# Altium schematic sheet 0207_TBT_0_HISPEED.SchDoc
size A3
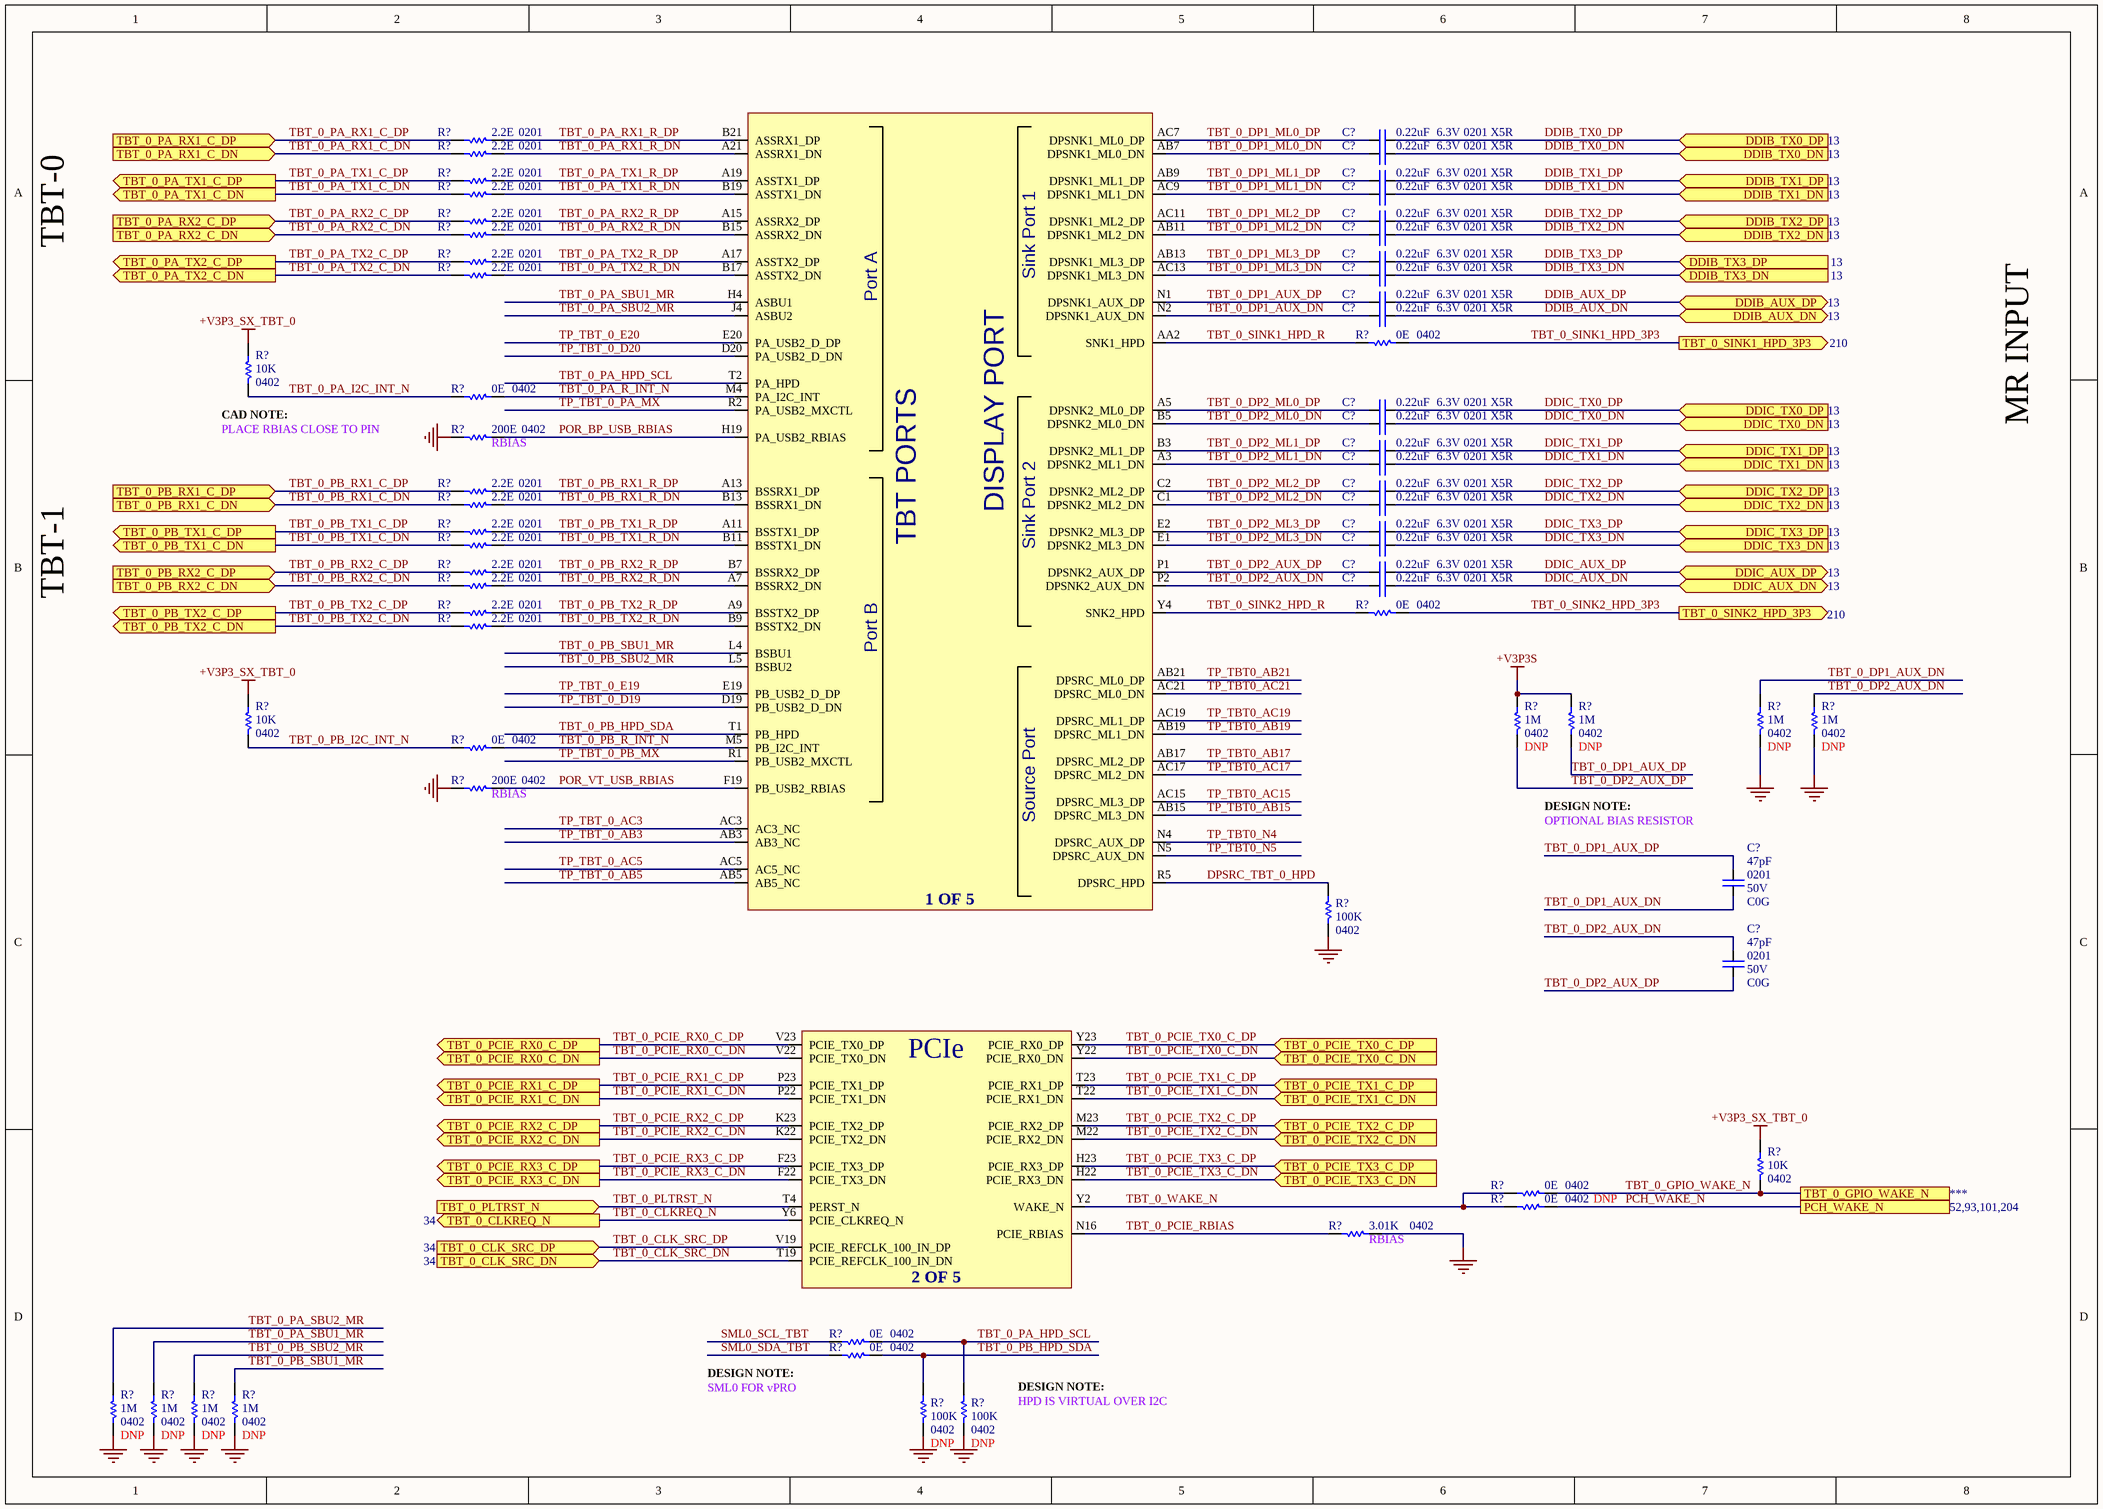
[diagram p0: 0207_TBT_0_HISPEED.SchDoc]

## Parts
(Parts that share a designator on the sheet are numbered #1, #2 ... from top to bottom, then left to right.)
C?#1  value 0.22uF  Case/Package: 0201  Voltage: 6.3V  Dielectric: X5R  [CAPC0201]
C?#2  value 0.22uF  Case/Package: 0201  Voltage: 6.3V  Dielectric: X5R  [CAPC0201]
C?#3  value 0.22uF  Case/Package: 0201  Voltage: 6.3V  Dielectric: X5R  [CAPC0201]
C?#4  value 0.22uF  Case/Package: 0201  Voltage: 6.3V  Dielectric: X5R  [CAPC0201]
C?#5  value 0.22uF  Case/Package: 0201  Voltage: 6.3V  Dielectric: X5R  [CAPC0201]
C?#6  value 0.22uF  Case/Package: 0201  Voltage: 6.3V  Dielectric: X5R  [CAPC0201]
C?#7  value 0.22uF  Case/Package: 0201  Voltage: 6.3V  Dielectric: X5R  [CAPC0201]
C?#8  value 0.22uF  Case/Package: 0201  Voltage: 6.3V  Dielectric: X5R  [CAPC0201]
C?#9  value 0.22uF  Case/Package: 0201  Voltage: 6.3V  Dielectric: X5R  [CAPC0201]
C?#10  value 0.22uF  Case/Package: 0201  Voltage: 6.3V  Dielectric: X5R  [CAPC0201]
C?#11  value 0.22uF  Case/Package: 0201  Voltage: 6.3V  Dielectric: X5R  [CAPC0201]
C?#12  value 0.22uF  Case/Package: 0201  Voltage: 6.3V  Dielectric: X5R  [CAPC0201]
C?#13  value 0.22uF  Case/Package: 0201  Voltage: 6.3V  Dielectric: X5R  [CAPC0201]
C?#14  value 0.22uF  Case/Package: 0201  Voltage: 6.3V  Dielectric: X5R  [CAPC0201]
C?#15  value 0.22uF  Case/Package: 0201  Voltage: 6.3V  Dielectric: X5R  [CAPC0201]
C?#16  value 0.22uF  Case/Package: 0201  Voltage: 6.3V  Dielectric: X5R  [CAPC0201]
C?#17  value 0.22uF  Case/Package: 0201  Voltage: 6.3V  Dielectric: X5R  [CAPC0201]
C?#18  value 0.22uF  Case/Package: 0201  Voltage: 6.3V  Dielectric: X5R  [CAPC0201]
C?#19  value 0.22uF  Case/Package: 0201  Voltage: 6.3V  Dielectric: X5R  [CAPC0201]
C?#20  value 0.22uF  Case/Package: 0201  Voltage: 6.3V  Dielectric: X5R  [CAPC0201]
C?#21  value 47pF  Case/Package: 0201  Voltage: 50V  Dielectric: C0G  [CAPC0201]
C?#22  value 47pF  Case/Package: 0201  Voltage: 50V  Dielectric: C0G  [CAPC0201]
R?#1  value 2.2E  Case/Package: 0201  [RESC0201]  (hidden comment: Res)
R?#2  value 2.2E  Case/Package: 0201  [RESC0201]  (hidden comment: Res)
R?#3  value 2.2E  Case/Package: 0201  [RESC0201]  (hidden comment: Res)
R?#4  value 2.2E  Case/Package: 0201  [RESC0201]  (hidden comment: Res)
R?#5  value 2.2E  Case/Package: 0201  [RESC0201]  (hidden comment: Res)
R?#6  value 2.2E  Case/Package: 0201  [RESC0201]  (hidden comment: Res)
R?#7  value 2.2E  Case/Package: 0201  [RESC0201]  (hidden comment: Res)
R?#8  value 2.2E  Case/Package: 0201  [RESC0201]  (hidden comment: Res)
R?#9  value 0E  Case/Package: 0402  [RESC0402]  (hidden comment: Res)
R?#10  value 10K  Case/Package: 0402  [RESC0402]  (hidden comment: Res)
R?#11  value 0E  Case/Package: 0402  [RESC0402]  (hidden comment: Res)
R?#12  value 200E  Case/Package: 0402  [RESC0402]  (hidden comment: Res)
R?#13  value 2.2E  Case/Package: 0201  [RESC0201]  (hidden comment: Res)
R?#14  value 2.2E  Case/Package: 0201  [RESC0201]  (hidden comment: Res)
R?#15  value 2.2E  Case/Package: 0201  [RESC0201]  (hidden comment: Res)
R?#16  value 2.2E  Case/Package: 0201  [RESC0201]  (hidden comment: Res)
R?#17  value 2.2E  Case/Package: 0201  [RESC0201]  (hidden comment: Res)
R?#18  value 2.2E  Case/Package: 0201  [RESC0201]  (hidden comment: Res)
R?#19  value 2.2E  Case/Package: 0201  [RESC0201]  (hidden comment: Res)
R?#20  value 0E  Case/Package: 0402  [RESC0402]  (hidden comment: Res)
R?#21  value 2.2E  Case/Package: 0201  [RESC0201]  (hidden comment: Res)
R?#22  value 10K  Case/Package: 0402  [RESC0402]  (hidden comment: Res)
R?#23  value 1M  Case/Package: 0402  [RESC0402]  (hidden comment: Res)
R?#24  value 1M  Case/Package: 0402  [RESC0402]  (hidden comment: Res)
R?#25  value 1M  Case/Package: 0402  [RESC0402]  (hidden comment: Res)
R?#26  value 1M  Case/Package: 0402  [RESC0402]  (hidden comment: Res)
R?#27  value 0E  Case/Package: 0402  [RESC0402]  (hidden comment: Res)
R?#28  value 200E  Case/Package: 0402  [RESC0402]  (hidden comment: Res)
R?#29  value 100K  Case/Package: 0402  [RESC0402]  (hidden comment: Res)
R?#30  value 10K  Case/Package: 0402  [RESC0402]  (hidden comment: Res)
R?#31  value 0E  Case/Package: 0402  [RESC0402]  (hidden comment: Res)
R?#32  value 0E  Case/Package: 0402  [RESC0402]  (hidden comment: Res)
R?#33  value 3.01K  Case/Package: 0402  [RESC0402]  (hidden comment: Res)
R?#34  value 0E  Case/Package: 0402  [RESC0402]  (hidden comment: Res)
R?#35  value 0E  Case/Package: 0402  [RESC0402]  (hidden comment: Res)
R?#36  value 1M  Case/Package: 0402  [RESC0402]  (hidden comment: Res)
R?#37  value 1M  Case/Package: 0402  [RESC0402]  (hidden comment: Res)
R?#38  value 1M  Case/Package: 0402  [RESC0402]  (hidden comment: Res)
R?#39  value 1M  Case/Package: 0402  [RESC0402]  (hidden comment: Res)
R?#40  value 100K  Case/Package: 0402  [RESC0402]  (hidden comment: Res)
R?#41  value 100K  Case/Package: 0402  [RESC0402]  (hidden comment: Res)
U5A2  C_MAPLE_RIDGE_DP  (value not drawn)  (parts A,B of 5)

## Ports
DDIB_AUX_DN (bidir), DDIB_AUX_DP (bidir), DDIB_TX0_DN (in), DDIB_TX0_DP (in), DDIB_TX1_DN (in), DDIB_TX1_DP (in), DDIB_TX2_DN (in), DDIB_TX2_DP (in), DDIB_TX3_DN (in), DDIB_TX3_DP (in), DDIC_AUX_DN (bidir), DDIC_AUX_DP (bidir), DDIC_TX0_DN (in), DDIC_TX0_DP (in), DDIC_TX1_DN (in), DDIC_TX1_DP (in), DDIC_TX2_DN (in), DDIC_TX2_DP (in), DDIC_TX3_DN (in), DDIC_TX3_DP (in), PCH_WAKE_N, TBT_0_CLK_SRC_DN (in), TBT_0_CLK_SRC_DP (in), TBT_0_CLKREQ_N (out), TBT_0_GPIO_WAKE_N, TBT_0_PA_RX1_C_DN (in), TBT_0_PA_RX1_C_DP (in), TBT_0_PA_RX2_C_DN (in), TBT_0_PA_RX2_C_DP (in), TBT_0_PA_TX1_C_DN (out), TBT_0_PA_TX1_C_DP (out), TBT_0_PA_TX2_C_DN (out), TBT_0_PA_TX2_C_DP (out), TBT_0_PB_RX1_C_DN (in), TBT_0_PB_RX1_C_DP (in), TBT_0_PB_RX2_C_DN (in), TBT_0_PB_RX2_C_DP (in), TBT_0_PB_TX1_C_DN (out), TBT_0_PB_TX1_C_DP (out), TBT_0_PB_TX2_C_DN (out), TBT_0_PB_TX2_C_DP (out), TBT_0_PCIE_RX0_C_DN (out), TBT_0_PCIE_RX0_C_DP (out), TBT_0_PCIE_RX1_C_DN (out), TBT_0_PCIE_RX1_C_DP (out), TBT_0_PCIE_RX2_C_DN (out), TBT_0_PCIE_RX2_C_DP (out), TBT_0_PCIE_RX3_C_DN (out), TBT_0_PCIE_RX3_C_DP (out), TBT_0_PCIE_TX0_C_DN (in), TBT_0_PCIE_TX0_C_DP (in), TBT_0_PCIE_TX1_C_DN (in), TBT_0_PCIE_TX1_C_DP (in), TBT_0_PCIE_TX2_C_DN (in), TBT_0_PCIE_TX2_C_DP (in), TBT_0_PCIE_TX3_C_DN (in), TBT_0_PCIE_TX3_C_DP (in), TBT_0_PLTRST_N (in), TBT_0_SINK1_HPD_3P3 (out), TBT_0_SINK2_HPD_3P3 (out)

## Nets
+V3P3_SX_TBT_0: R?#10.2 R?#22.2 R?#30.2
+V3P3S: R?#23.2 R?#24.2
GND: R?#12.1 R?#25.1 R?#26.1 R?#28.1 R?#29.1 R?#33.1 R?#36.1 R?#37.1 R?#38.1 R?#39.1 R?#40.1 R?#41.1
DDIB_AUX_DN: C?#10.2 ; port DDIB_AUX_DN
DDIB_AUX_DP: C?#9.2 ; port DDIB_AUX_DP
DDIB_TX0_DN: C?#2.2 ; port DDIB_TX0_DN
DDIB_TX0_DP: C?#1.2 ; port DDIB_TX0_DP
DDIB_TX1_DN: C?#4.2 ; port DDIB_TX1_DN
DDIB_TX1_DP: C?#3.2 ; port DDIB_TX1_DP
DDIB_TX2_DN: C?#6.2 ; port DDIB_TX2_DN
DDIB_TX2_DP: C?#5.2 ; port DDIB_TX2_DP
DDIB_TX3_DN: C?#8.2 ; port DDIB_TX3_DN
DDIB_TX3_DP: C?#7.2 ; port DDIB_TX3_DP
DDIC_AUX_DN: C?#20.2 ; port DDIC_AUX_DN
DDIC_AUX_DP: C?#19.2 ; port DDIC_AUX_DP
DDIC_TX0_DN: C?#12.2 ; port DDIC_TX0_DN
DDIC_TX0_DP: C?#11.2 ; port DDIC_TX0_DP
DDIC_TX1_DN: C?#14.2 ; port DDIC_TX1_DN
DDIC_TX1_DP: C?#13.2 ; port DDIC_TX1_DP
DDIC_TX2_DN: C?#16.2 ; port DDIC_TX2_DN
DDIC_TX2_DP: C?#15.2 ; port DDIC_TX2_DP
DDIC_TX3_DN: C?#18.2 ; port DDIC_TX3_DN
DDIC_TX3_DP: C?#17.2 ; port DDIC_TX3_DP
DPSRC_TBT_0_HPD: R?#29.2 U5A2.R5(DPSRC_HPD)
PCH_WAKE_N: R?#32.2 ; port PCH_WAKE_N
POR_BP_USB_RBIAS: R?#12.2 U5A2.H19(PA_USB2_RBIAS)
POR_VT_USB_RBIAS: R?#28.2 U5A2.F19(PB_USB2_RBIAS)
SML0_SCL_TBT: R?#34.1
SML0_SDA_TBT: R?#35.1
TBT_0_CLK_SRC_DN: U5A2.T19(PCIE_REFCLK_100_IN_DN) ; port TBT_0_CLK_SRC_DN
TBT_0_CLK_SRC_DP: U5A2.V19(PCIE_REFCLK_100_IN_DP) ; port TBT_0_CLK_SRC_DP
TBT_0_CLKREQ_N: U5A2.Y6(PCIE_CLKREQ_N) ; port TBT_0_CLKREQ_N
TBT_0_DP1_AUX_DN: C?#10.1 C?#21.2 R?#25.2 U5A2.N2(DPSNK1_AUX_DN)
TBT_0_DP1_AUX_DP: C?#9.1 C?#21.1 R?#24.1 U5A2.N1(DPSNK1_AUX_DP)
TBT_0_DP1_ML0_DN: C?#2.1 U5A2.AB7(DPSNK1_ML0_DN)
TBT_0_DP1_ML0_DP: C?#1.1 U5A2.AC7(DPSNK1_ML0_DP)
TBT_0_DP1_ML1_DN: C?#4.1 U5A2.AC9(DPSNK1_ML1_DN)
TBT_0_DP1_ML1_DP: C?#3.1 U5A2.AB9(DPSNK1_ML1_DP)
TBT_0_DP1_ML2_DN: C?#6.1 U5A2.AB11(DPSNK1_ML2_DN)
TBT_0_DP1_ML2_DP: C?#5.1 U5A2.AC11(DPSNK1_ML2_DP)
TBT_0_DP1_ML3_DN: C?#8.1 U5A2.AC13(DPSNK1_ML3_DN)
TBT_0_DP1_ML3_DP: C?#7.1 U5A2.AB13(DPSNK1_ML3_DP)
TBT_0_DP2_AUX_DN: C?#20.1 C?#22.1 R?#26.2 U5A2.P2(DPSNK2_AUX_DN)
TBT_0_DP2_AUX_DP: C?#19.1 C?#22.2 R?#23.1 U5A2.P1(DPSNK2_AUX_DP)
TBT_0_DP2_ML0_DN: C?#12.1 U5A2.B5(DPSNK2_ML0_DN)
TBT_0_DP2_ML0_DP: C?#11.1 U5A2.A5(DPSNK2_ML0_DP)
TBT_0_DP2_ML1_DN: C?#14.1 U5A2.A3(DPSNK2_ML1_DN)
TBT_0_DP2_ML1_DP: C?#13.1 U5A2.B3(DPSNK2_ML1_DP)
TBT_0_DP2_ML2_DN: C?#16.1 U5A2.C1(DPSNK2_ML2_DN)
TBT_0_DP2_ML2_DP: C?#15.1 U5A2.C2(DPSNK2_ML2_DP)
TBT_0_DP2_ML3_DN: C?#18.1 U5A2.E1(DPSNK2_ML3_DN)
TBT_0_DP2_ML3_DP: C?#17.1 U5A2.E2(DPSNK2_ML3_DP)
TBT_0_GPIO_WAKE_N: R?#30.1 R?#31.2 ; port TBT_0_GPIO_WAKE_N
TBT_0_PA_HPD_SCL: R?#34.2 R?#41.2 U5A2.T2(PA_HPD)
TBT_0_PA_I2C_INT_N: R?#10.1 R?#11.1
TBT_0_PA_R_INT_N: R?#11.2 U5A2.M4(PA_I2C_INT)
TBT_0_PA_RX1_C_DN: R?#2.1 ; port TBT_0_PA_RX1_C_DN
TBT_0_PA_RX1_C_DP: R?#1.1 ; port TBT_0_PA_RX1_C_DP
TBT_0_PA_RX1_R_DN: R?#2.2 U5A2.A21(ASSRX1_DN)
TBT_0_PA_RX1_R_DP: R?#1.2 U5A2.B21(ASSRX1_DP)
TBT_0_PA_RX2_C_DN: R?#6.1 ; port TBT_0_PA_RX2_C_DN
TBT_0_PA_RX2_C_DP: R?#5.1 ; port TBT_0_PA_RX2_C_DP
TBT_0_PA_RX2_R_DN: R?#6.2 U5A2.B15(ASSRX2_DN)
TBT_0_PA_RX2_R_DP: R?#5.2 U5A2.A15(ASSRX2_DP)
TBT_0_PA_SBU1_MR: R?#37.2 U5A2.H4(ASBU1)
TBT_0_PA_SBU2_MR: R?#36.2 U5A2.J4(ASBU2)
TBT_0_PA_TX1_C_DN: R?#4.1 ; port TBT_0_PA_TX1_C_DN
TBT_0_PA_TX1_C_DP: R?#3.1 ; port TBT_0_PA_TX1_C_DP
TBT_0_PA_TX1_R_DN: R?#4.2 U5A2.B19(ASSTX1_DN)
TBT_0_PA_TX1_R_DP: R?#3.2 U5A2.A19(ASSTX1_DP)
TBT_0_PA_TX2_C_DN: R?#8.1 ; port TBT_0_PA_TX2_C_DN
TBT_0_PA_TX2_C_DP: R?#7.1 ; port TBT_0_PA_TX2_C_DP
TBT_0_PA_TX2_R_DN: R?#8.2 U5A2.B17(ASSTX2_DN)
TBT_0_PA_TX2_R_DP: R?#7.2 U5A2.A17(ASSTX2_DP)
TBT_0_PB_HPD_SDA: R?#35.2 R?#40.2 U5A2.T1(PB_HPD)
TBT_0_PB_I2C_INT_N: R?#22.1 R?#27.1
TBT_0_PB_R_INT_N: R?#27.2 U5A2.M5(PB_I2C_INT)
TBT_0_PB_RX1_C_DN: R?#14.1 ; port TBT_0_PB_RX1_C_DN
TBT_0_PB_RX1_C_DP: R?#13.1 ; port TBT_0_PB_RX1_C_DP
TBT_0_PB_RX1_R_DN: R?#14.2 U5A2.B13(BSSRX1_DN)
TBT_0_PB_RX1_R_DP: R?#13.2 U5A2.A13(BSSRX1_DP)
TBT_0_PB_RX2_C_DN: R?#18.1 ; port TBT_0_PB_RX2_C_DN
TBT_0_PB_RX2_C_DP: R?#17.1 ; port TBT_0_PB_RX2_C_DP
TBT_0_PB_RX2_R_DN: R?#18.2 U5A2.A7(BSSRX2_DN)
TBT_0_PB_RX2_R_DP: R?#17.2 U5A2.B7(BSSRX2_DP)
TBT_0_PB_SBU1_MR: R?#39.2 U5A2.L4(BSBU1)
TBT_0_PB_SBU2_MR: R?#38.2 U5A2.L5(BSBU2)
TBT_0_PB_TX1_C_DN: R?#16.1 ; port TBT_0_PB_TX1_C_DN
TBT_0_PB_TX1_C_DP: R?#15.1 ; port TBT_0_PB_TX1_C_DP
TBT_0_PB_TX1_R_DN: R?#16.2 U5A2.B11(BSSTX1_DN)
TBT_0_PB_TX1_R_DP: R?#15.2 U5A2.A11(BSSTX1_DP)
TBT_0_PB_TX2_C_DN: R?#21.1 ; port TBT_0_PB_TX2_C_DN
TBT_0_PB_TX2_C_DP: R?#19.1 ; port TBT_0_PB_TX2_C_DP
TBT_0_PB_TX2_R_DN: R?#21.2 U5A2.B9(BSSTX2_DN)
TBT_0_PB_TX2_R_DP: R?#19.2 U5A2.A9(BSSTX2_DP)
TBT_0_PCIE_RBIAS: R?#33.2 U5A2.N16(PCIE_RBIAS)
TBT_0_PCIE_RX0_C_DN: U5A2.V22(PCIE_TX0_DN) ; port TBT_0_PCIE_RX0_C_DN
TBT_0_PCIE_RX0_C_DP: U5A2.V23(PCIE_TX0_DP) ; port TBT_0_PCIE_RX0_C_DP
TBT_0_PCIE_RX1_C_DN: U5A2.P22(PCIE_TX1_DN) ; port TBT_0_PCIE_RX1_C_DN
TBT_0_PCIE_RX1_C_DP: U5A2.P23(PCIE_TX1_DP) ; port TBT_0_PCIE_RX1_C_DP
TBT_0_PCIE_RX2_C_DN: U5A2.K22(PCIE_TX2_DN) ; port TBT_0_PCIE_RX2_C_DN
TBT_0_PCIE_RX2_C_DP: U5A2.K23(PCIE_TX2_DP) ; port TBT_0_PCIE_RX2_C_DP
TBT_0_PCIE_RX3_C_DN: U5A2.F22(PCIE_TX3_DN) ; port TBT_0_PCIE_RX3_C_DN
TBT_0_PCIE_RX3_C_DP: U5A2.F23(PCIE_TX3_DP) ; port TBT_0_PCIE_RX3_C_DP
TBT_0_PCIE_TX0_C_DN: U5A2.Y22(PCIE_RX0_DN) ; port TBT_0_PCIE_TX0_C_DN
TBT_0_PCIE_TX0_C_DP: U5A2.Y23(PCIE_RX0_DP) ; port TBT_0_PCIE_TX0_C_DP
TBT_0_PCIE_TX1_C_DN: U5A2.T22(PCIE_RX1_DN) ; port TBT_0_PCIE_TX1_C_DN
TBT_0_PCIE_TX1_C_DP: U5A2.T23(PCIE_RX1_DP) ; port TBT_0_PCIE_TX1_C_DP
TBT_0_PCIE_TX2_C_DN: U5A2.M22(PCIE_RX2_DN) ; port TBT_0_PCIE_TX2_C_DN
TBT_0_PCIE_TX2_C_DP: U5A2.M23(PCIE_RX2_DP) ; port TBT_0_PCIE_TX2_C_DP
TBT_0_PCIE_TX3_C_DN: U5A2.H22(PCIE_RX3_DN) ; port TBT_0_PCIE_TX3_C_DN
TBT_0_PCIE_TX3_C_DP: U5A2.H23(PCIE_RX3_DP) ; port TBT_0_PCIE_TX3_C_DP
TBT_0_PLTRST_N: U5A2.T4(PERST_N) ; port TBT_0_PLTRST_N
TBT_0_SINK1_HPD_3P3: R?#9.2 ; port TBT_0_SINK1_HPD_3P3
TBT_0_SINK1_HPD_R: R?#9.1 U5A2.AA2(SNK1_HPD)
TBT_0_SINK2_HPD_3P3: R?#20.2 ; port TBT_0_SINK2_HPD_3P3
TBT_0_SINK2_HPD_R: R?#20.1 U5A2.Y4(SNK2_HPD)
TBT_0_WAKE_N: R?#31.1 R?#32.1 U5A2.Y2(WAKE_N)
TP_TBT0_AB15: U5A2.AB15(DPSRC_ML3_DN)
TP_TBT0_AB17: U5A2.AB17(DPSRC_ML2_DP)
TP_TBT0_AB19: U5A2.AB19(DPSRC_ML1_DN)
TP_TBT0_AB21: U5A2.AB21(DPSRC_ML0_DP)
TP_TBT0_AC15: U5A2.AC15(DPSRC_ML3_DP)
TP_TBT0_AC17: U5A2.AC17(DPSRC_ML2_DN)
TP_TBT0_AC19: U5A2.AC19(DPSRC_ML1_DP)
TP_TBT0_AC21: U5A2.AC21(DPSRC_ML0_DN)
TP_TBT0_N4: U5A2.N4(DPSRC_AUX_DP)
TP_TBT0_N5: U5A2.N5(DPSRC_AUX_DN)
TP_TBT_0_AB3: U5A2.AB3(AB3_NC)
TP_TBT_0_AB5: U5A2.AB5(AB5_NC)
TP_TBT_0_AC3: U5A2.AC3(AC3_NC)
TP_TBT_0_AC5: U5A2.AC5(AC5_NC)
TP_TBT_0_D19: U5A2.D19(PB_USB2_D_DN)
TP_TBT_0_D20: U5A2.D20(PA_USB2_D_DN)
TP_TBT_0_E19: U5A2.E19(PB_USB2_D_DP)
TP_TBT_0_E20: U5A2.E20(PA_USB2_D_DP)
TP_TBT_0_PA_MX: U5A2.R2(PA_USB2_MXCTL)
TP_TBT_0_PB_MX: U5A2.R1(PB_USB2_MXCTL)

## Notes on the sheet
- TBT-0
- MR INPUT
- (near R?#10) CAD NOTE:
- (near R?#10) PLACE RBIAS CLOSE TO PIN
- (near R?#12) RBIAS
- TBT-1
- (near R?#28) RBIAS
- DESIGN NOTE:
- OPTIONAL BIAS RESISTOR
- (near R?#33) RBIAS
- SML0 FOR vPRO
- HPD IS VIRTUAL OVER I2C
- (in symbol C_MAPLE_RIDGE_DP, part A) Sink Port 1; Port A; DISPLAY PORT; Sink Port 2; TBT PORTS; Port B; Source Port; 1 OF 5
- (in symbol C_MAPLE_RIDGE_DP, part B) PCIe; 2 OF 5

## Library data of the parts
C?#1-C?#20 = Cap: CAP CER 0.22uF 6.3V X5R 0201
C?#21 C?#22 = Cap: CAP CER 47pF 50V C0G 0201
R?#1-R?#8 R?#13-R?#19 R?#21 = Res: Thick Film Resistor -  2.2ohm, 1%, 0201
R?#9 R?#11 R?#20 R?#27 R?#31 R?#32 R?#34 R?#35 = Res: Thick Film Resistor -  0ohm, 1%, 0402
  R?#32: DNP: DNP
R?#10 R?#22 R?#30 R?#33 = Res: Thick Film Resistor -  10Kohm, 1%, 0402
R?#12 R?#28 = Res: Thick Film Resistor -  200ohm, 1%, 0402
R?#23-R?#26 R?#36-R?#39 = Res: Thick Film Resistor -  1Mohm, 1%, 0402; DNP: DNP
R?#29 R?#40 R?#41 = Res: Thick Film Resistor -  100Kohm, 1%, 0402
  R?#40 R?#41: DNP: DNP
U5A2 = C_MAPLE_RIDGE_DP: Case/Package: *; Manufacturer Part Number: *